# EAGLE design STM32BluePill (EAGLE 9.6.2)

## Sheet 1 of 5
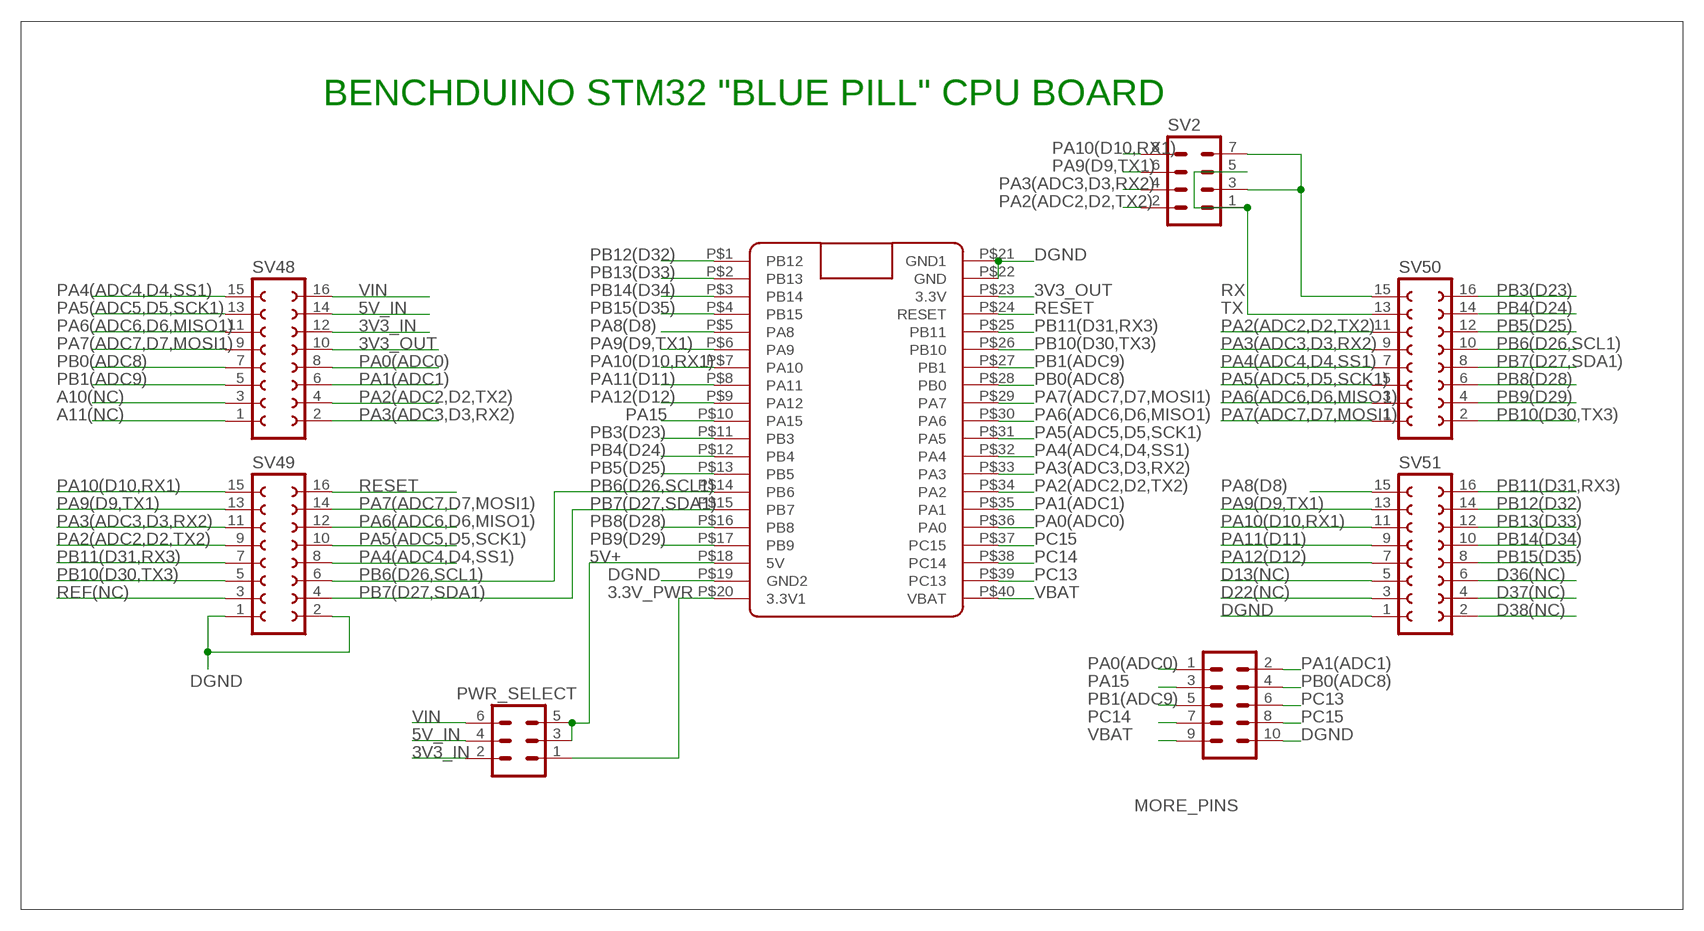
[diagram p0: schematic, sheet 1]

### Parts
MORE_PINS  MA05-2  [MA05-2]
PWR_SELECT  MA03-2  [MA03-2]
SV2  MA04-2  [MA04-2]
SV48  FE08-2  [FE08-2]
SV49  FE08-2  [FE08-2]
SV50  FE08-2  [FE08-2]
SV51  FE08-2  [FE08-2]
U$1  BLUE_PILLADVANCED  [BLUE_PILL_ADV]

### Nets
3.3V_PWR: PWR_SELECT.1 U$1.P$20(3.3V1)
3V3_IN: PWR_SELECT.2 SV48.12
3V3_OUT: SV48.10 U$1.P$23(3.3V)
5V+: PWR_SELECT.3 PWR_SELECT.5 U$1.P$18(5V)
5V_IN: PWR_SELECT.4 SV48.14
A10(NC): SV48.3
A11(NC): SV48.1
D13(NC): SV51.5
D22(NC): SV51.3
D36(NC): SV51.6
D37(NC): SV51.4
D38(NC): SV51.2
DGND: MORE_PINS.10 SV49.1 SV49.2 SV51.1 U$1.P$19(GND2) U$1.P$21(GND1) U$1.P$22(GND)
PA0(ADC0): MORE_PINS.1 SV48.8 U$1.P$36(PA0)
PA1(ADC1): MORE_PINS.2 SV48.6 U$1.P$35(PA1)
PA2(ADC2,D2,TX2): SV2.2 SV48.4 SV49.9 SV50.11 U$1.P$34(PA2)
PA3(ADC3,D3,RX2): SV2.4 SV48.2 SV49.11 SV50.9 U$1.P$33(PA3)
PA4(ADC4,D4,SS1): SV48.15 SV49.8 SV50.7 U$1.P$32(PA4)
PA5(ADC5,D5,SCK1): SV48.13 SV49.10 SV50.5 U$1.P$31(PA5)
PA6(ADC6,D6,MISO1): SV48.11 SV49.12 SV50.3 U$1.P$30(PA6)
PA7(ADC7,D7,MOSI1): SV48.9 SV49.14 SV50.1 U$1.P$29(PA7)
PA8(D8): SV51.15 U$1.P$5(PA8)
PA9(D9,TX1): SV2.6 SV49.13 SV51.13 U$1.P$6(PA9)
PA10(D10,RX1): SV2.8 SV49.15 SV51.11 U$1.P$7(PA10)
PA11(D11): SV51.9 U$1.P$8(PA11)
PA12(D12): SV51.7 U$1.P$9(PA12)
PA15: MORE_PINS.3 U$1.P$10(PA15)
PB0(ADC8): MORE_PINS.4 SV48.7 U$1.P$28(PB0)
PB1(ADC9): MORE_PINS.5 SV48.5 U$1.P$27(PB1)
PB3(D23): SV50.16 U$1.P$11(PB3)
PB4(D24): SV50.14 U$1.P$12(PB4)
PB5(D25): SV50.12 U$1.P$13(PB5)
PB6(D26,SCL1): SV49.6 SV50.10 U$1.P$14(PB6)
PB7(D27,SDA1): SV49.4 SV50.8 U$1.P$15(PB7)
PB8(D28): SV50.6 U$1.P$16(PB8)
PB9(D29): SV50.4 U$1.P$17(PB9)
PB10(D30,TX3): SV49.5 SV50.2 U$1.P$26(PB10)
PB11(D31,RX3): SV49.7 SV51.16 U$1.P$25(PB11)
PB12(D32): SV51.14 U$1.P$1(PB12)
PB13(D33): SV51.12 U$1.P$2(PB13)
PB14(D34): SV51.10 U$1.P$3(PB14)
PB15(D35): SV51.8 U$1.P$4(PB15)
PC13: MORE_PINS.6 U$1.P$39(PC13)
PC14: MORE_PINS.7 U$1.P$38(PC14)
PC15: MORE_PINS.8 U$1.P$37(PC15)
REF(NC): SV49.3
RESET: SV49.16 U$1.P$24(RESET)
RX: SV2.3 SV2.7 SV50.15
TX: SV2.1 SV2.5 SV50.13
VBAT: MORE_PINS.9 U$1.P$40(VBAT)
VIN: PWR_SELECT.6 SV48.16

### Notes on the sheet
- BENCHDUINO STM32 "BLUE PILL" CPU BOARD

## Sheet 2 of 5

## Sheet 3 of 5

## Sheet 4 of 5

## Sheet 5 of 5

## Library data of the parts
MORE_PINS = con-lstb:MA05-2: PIN HEADER; OC_FARNELL: unknown; OC_NEWARK: unknown
PWR_SELECT = con-lstb:MA03-2: PIN HEADER; OC_FARNELL: unknown; OC_NEWARK: unknown
SV2 = con-lstb:MA04-2: PIN HEADER; OC_FARNELL: unknown; OC_NEWARK: unknown
SV48-SV51 = con-lsta:FE08-2: FEMALE HEADER; OC_FARNELL: unknown; OC_NEWARK: unknown
U$1 = BluePill:BLUE_PILL

## Board
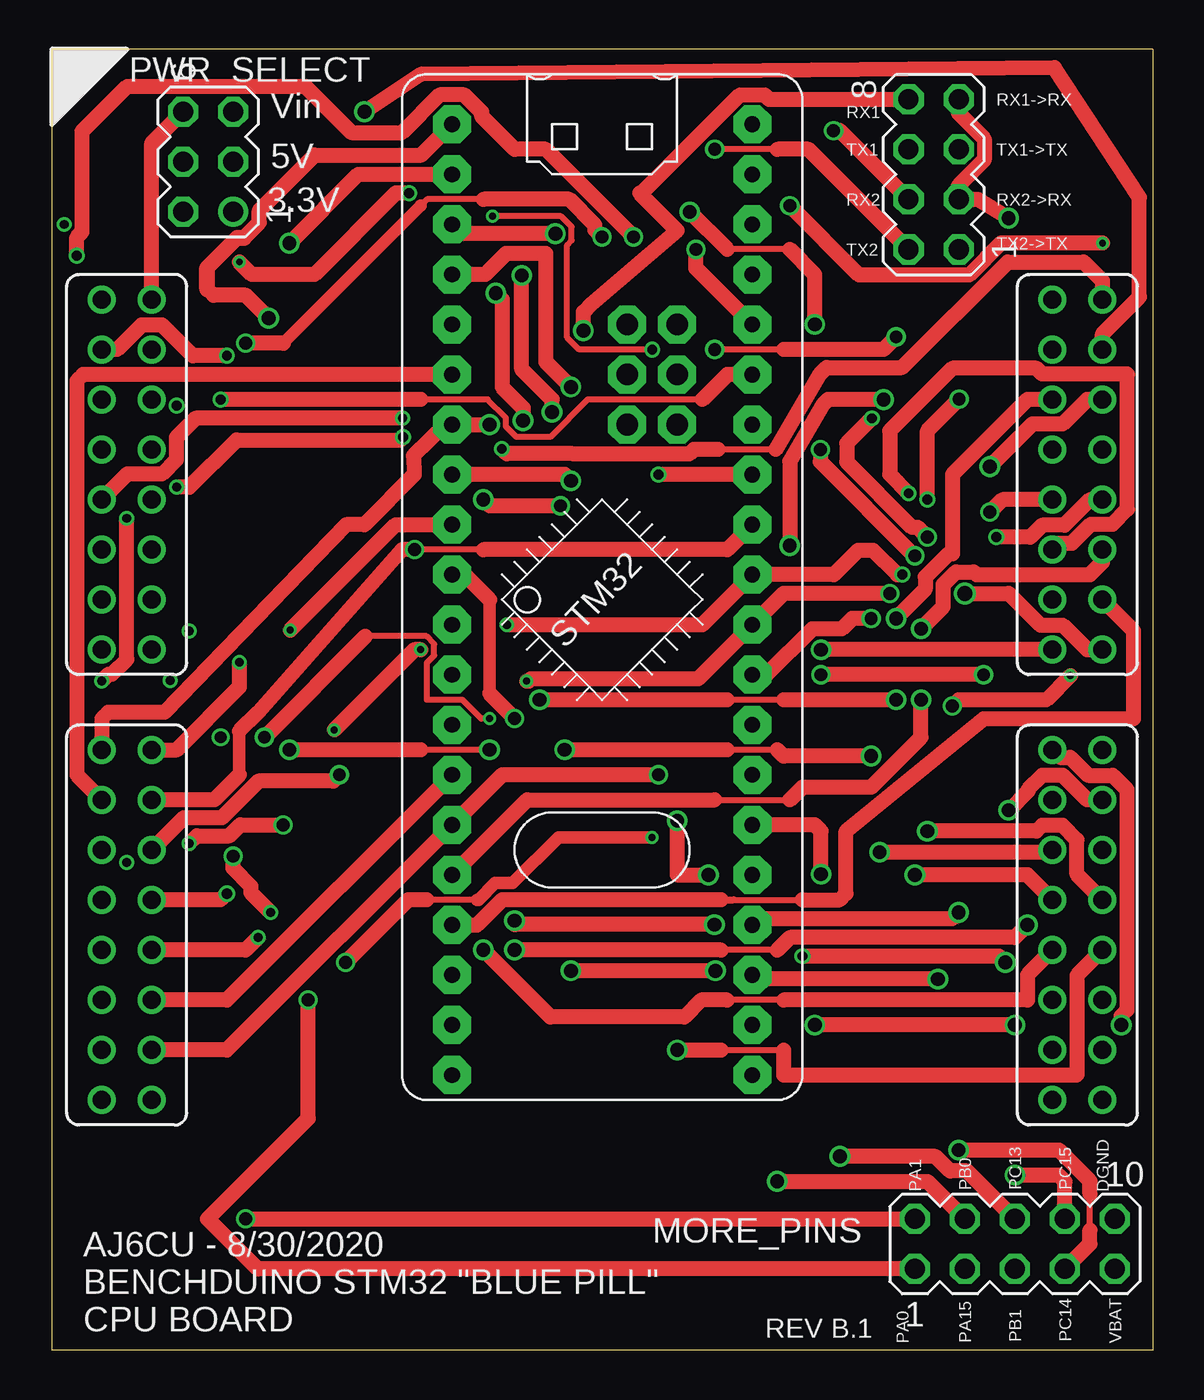
[diagram p1: board, top side]
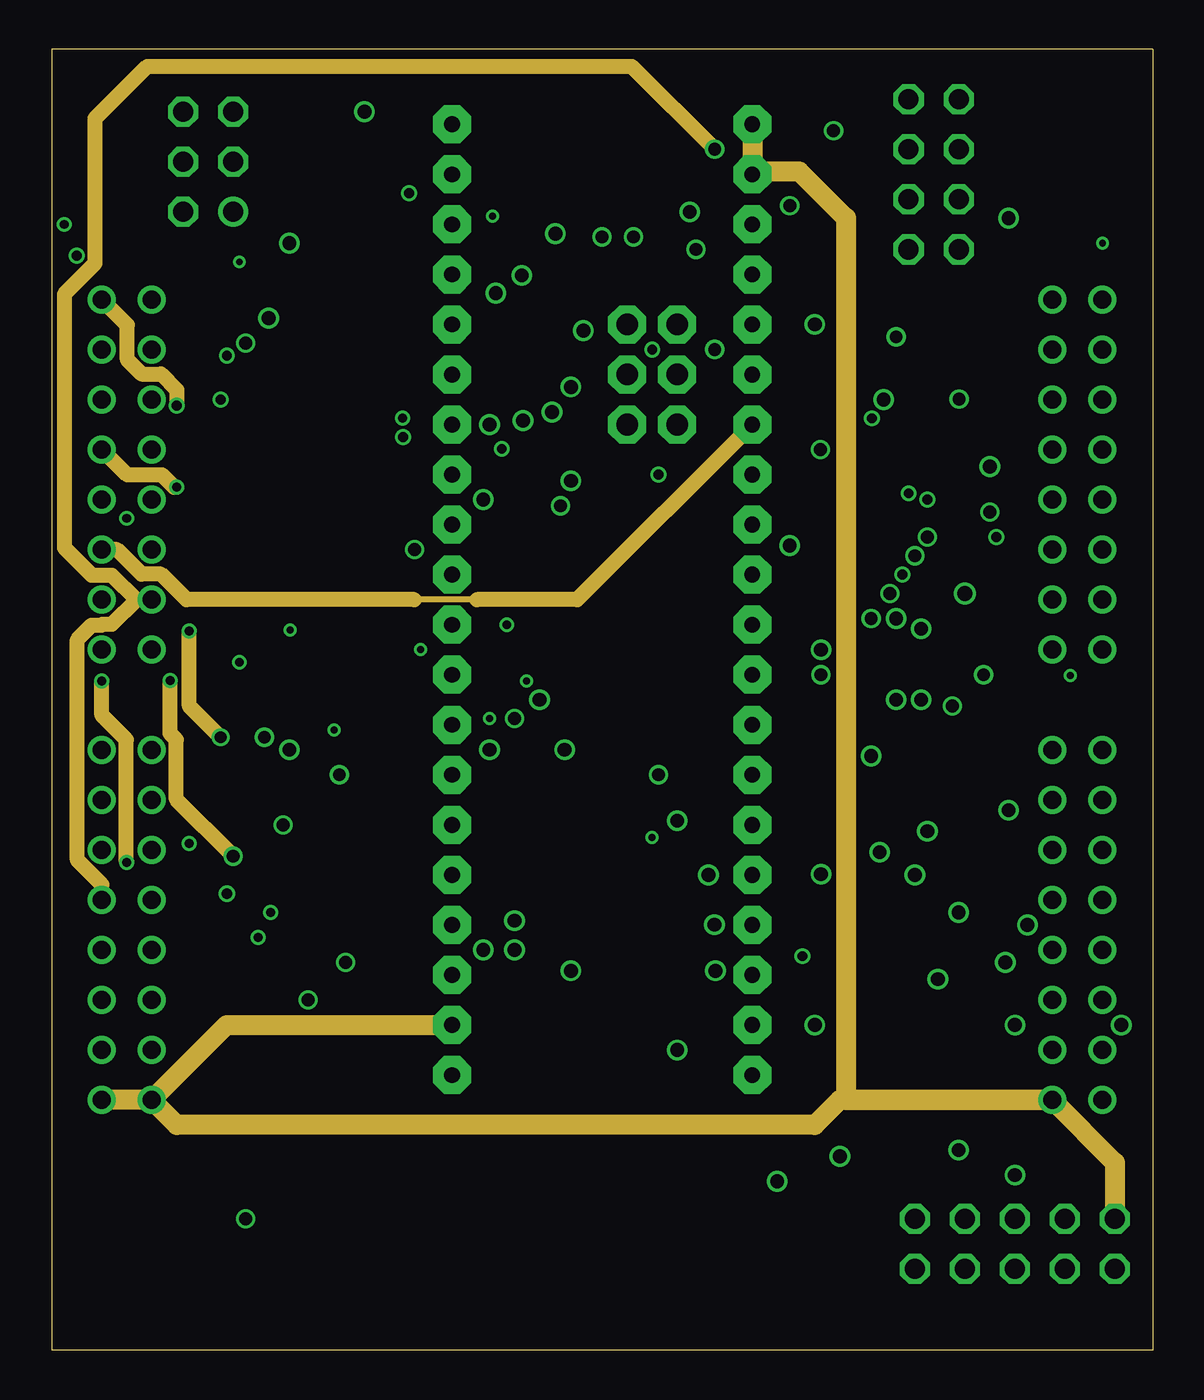
[diagram p2: board, inner layer Route2]
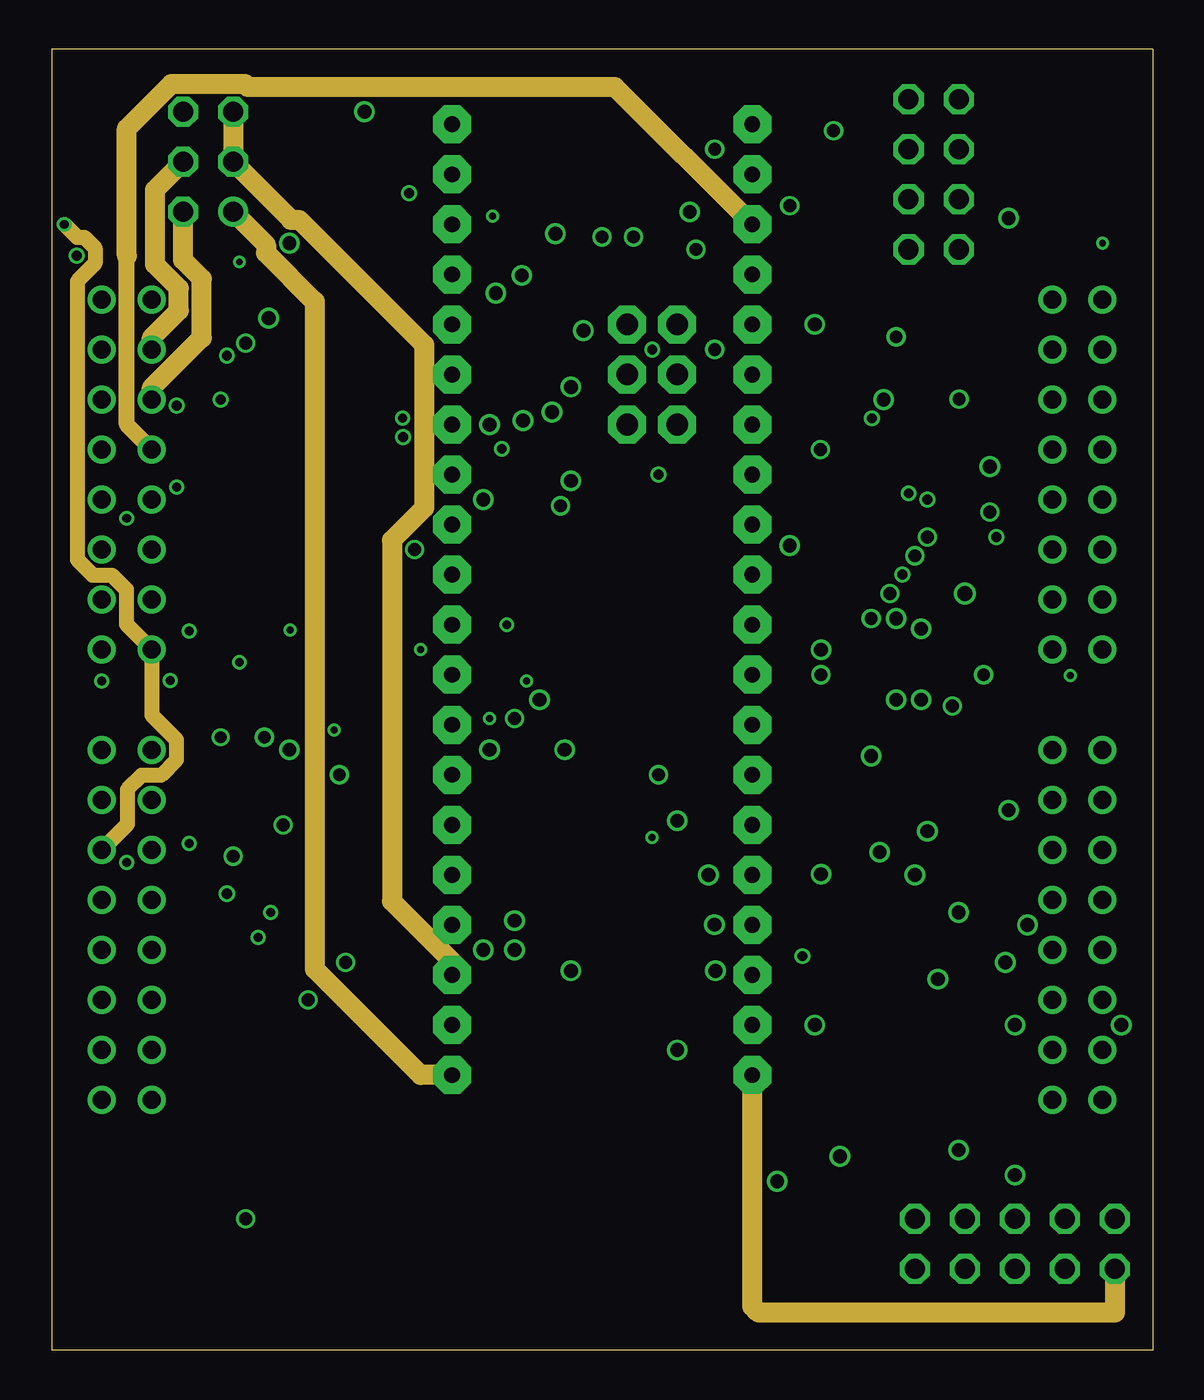
[diagram p3: board, inner layer Route15]
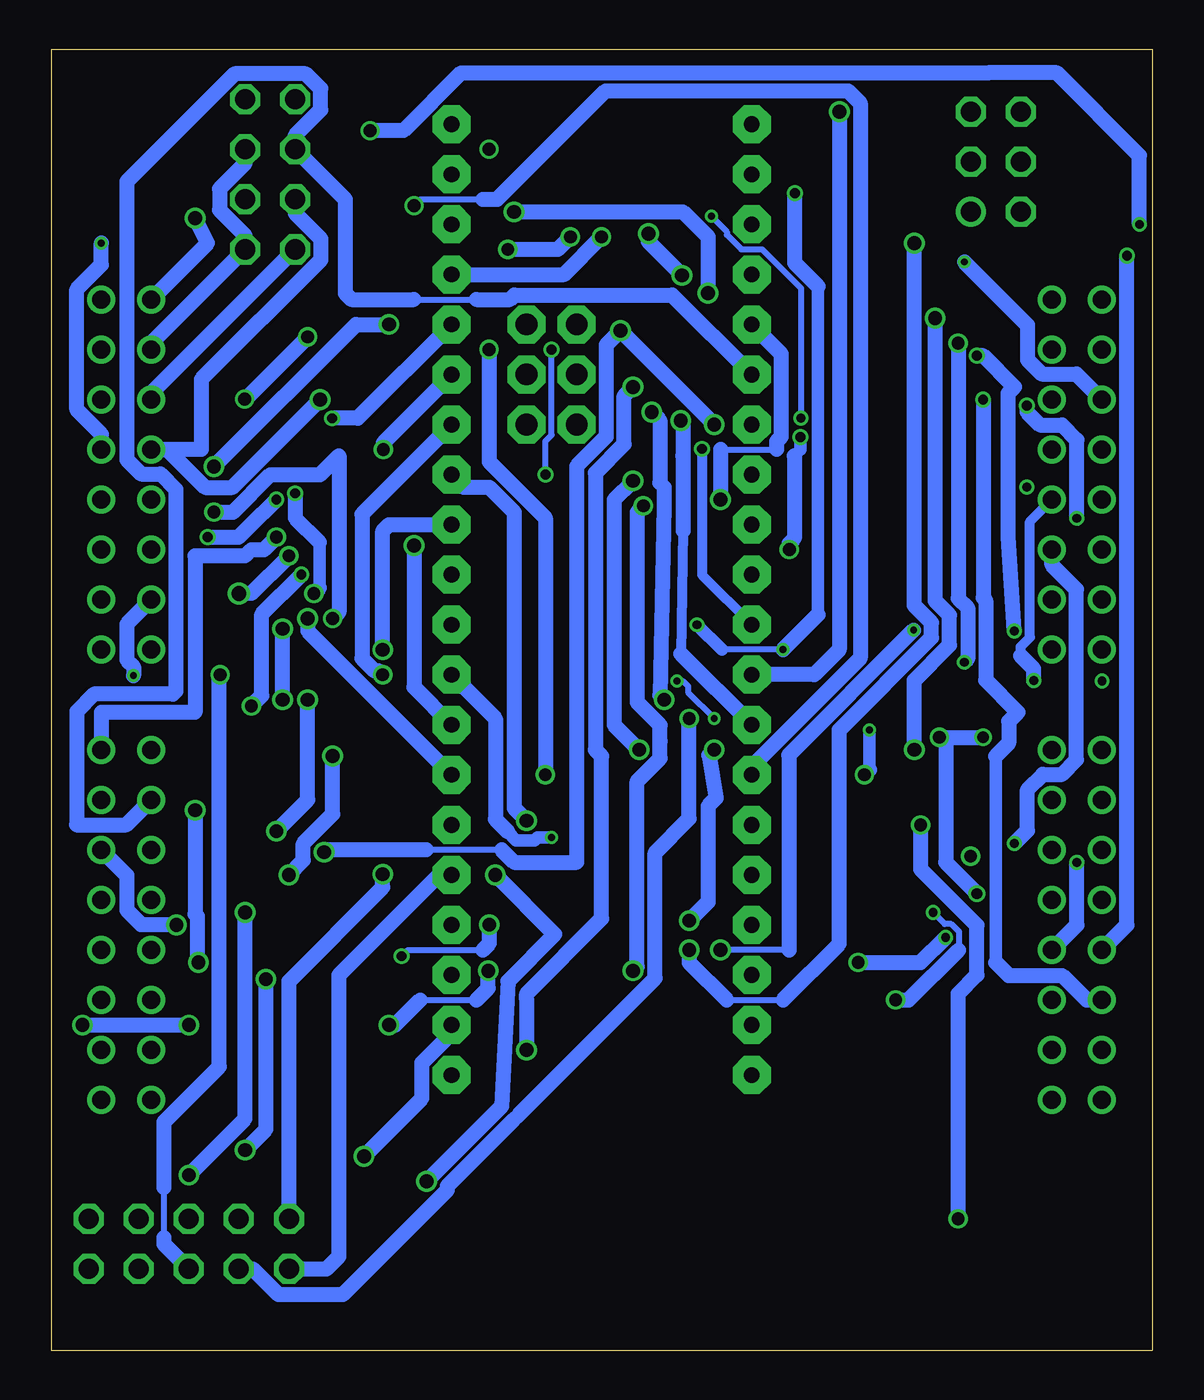
[diagram p4: board, bottom side, seen from below]

Size 55.88 x 66.04 mm. Coordinates in mm from the lower left corner, seen from the top.
Outline: 0,66.04 0,0 55.88,0 55.88,66.04 0,66.04
Copper layers (1*2*15*16): Top 0.035mm / dielectric 1.5mm / Route2 0.035mm / dielectric 0.15mm / Route15 0.035mm / dielectric 0.2mm / Bottom 0.035mm
Design rules "default *": minimum track width 6mil, minimum drill 12mil, track to track 6mil, track to pad 6mil, pad to pad 6mil, via to via 6mil, smd to smd 0mil, copper to edge 10mil, drill to drill 10mil, minimum pad ring 10mil, minimum via ring 6mil, stop-mask expansion 2mil, vias tented up to drill 100mil, thermal gap 10mil

### Footprints (pad centres in the part's own frame; a part is rotated, then mirrored left to right if it is on the bottom)
MA05-2 = drill 1.016 octagon: 1 -5.08,-1.27; 2 -5.08,1.27; 3 -2.54,-1.27; 4 -2.54,1.27; 5 0,-1.27; 6 0,1.27; 7 2.54,-1.27; 8 2.54,1.27; 9 5.08,-1.27; 10 5.08,1.27
MA03-2 = drill 1.016: 1 -2.54,-1.27 | drill 1.016 octagon: 2 -2.54,1.27; 3 0,-1.27; 4 0,1.27; 5 2.54,-1.27; 6 2.54,1.27
MA04-2 = drill 1.016 octagon: 1 -3.81,-1.27; 2 -3.81,1.27; 3 -1.27,-1.27; 4 -1.27,1.27; 5 1.27,-1.27; 6 1.27,1.27; 7 3.81,-1.27; 8 3.81,1.27
FE08-2 = drill 0.914: 1 -8.89,1.27; 2 -8.89,-1.27; 3 -6.35,1.27; 4 -6.35,-1.27; 5 -3.81,1.27; 6 -3.81,-1.27; 7 -1.27,1.27; 8 -1.27,-1.27; 9 1.27,1.27; 10 1.27,-1.27; 11 3.81,1.27; 12 3.81,-1.27; 13 6.35,1.27; 14 6.35,-1.27; 15 8.89,1.27; 16 8.89,-1.27
BLUE_PILL_ADV = drill 0.8 pad 1.93 octagon: P$1 10.16,-30.48; P$2 10.16,-27.94; P$3 10.16,-25.4; P$4 10.16,-22.86; P$5 10.16,-20.32; P$6 10.16,-17.78; P$7 10.16,-15.24; P$8 10.16,-12.7; P$9 10.16,-10.16; P$10 10.16,-7.62; P$11 10.16,-5.08; P$12 10.16,-2.54; P$13 10.16,0; P$14 10.16,2.54; P$15 10.16,5.08; P$16 10.16,7.62; P$17 10.16,10.16; P$18 10.16,12.7; P$19 10.16,15.24; P$20 10.16,17.78; P$21 -5.08,-30.48; P$22 -5.08,-27.94; P$23 -5.08,-25.4; P$24 -5.08,-22.86; P$25 -5.08,-20.32; P$26 -5.08,-17.78; P$27 -5.08,-15.24; P$28 -5.08,-12.7; P$29 -5.08,-10.16; P$30 -5.08,-7.62; P$31 -5.08,-5.08; P$32 -5.08,-2.54; P$33 -5.08,0; P$34 -5.08,2.54; P$35 -5.08,5.08; P$36 -5.08,7.62; P$37 -5.08,10.16; P$38 -5.08,12.7; P$39 -5.08,15.24; P$40 -5.08,17.78 | drill 1.1 pad 1.93 octagon: P$42 -1.27,-20.32; P$43 -1.27,-17.78; P$44 -1.27,-15.24; P$45 1.27,-15.24; P$46 1.27,-17.78; P$47 1.27,-20.32

### Placement (x,y rotation side)
MORE_PINS  48.9,5.4 0 top
PWR_SELECT  7.94,60.33 90 top
SV2  44.77,59.69 90 top
SV48  3.81,44.45 90 top
SV49  3.81,21.59 90 top
SV50  52.07,44.45 90 top
SV51  52.07,21.59 90 top
U$1  30.48,31.75 180 top

### Tracks (layer width: path | path; a pad name or v marks a point on that pad's centre or on a via)
3.3V_PWR
  Route15 1.016: U$1.P$20 18.73,13.97 13.35,19.36 13.35,53.24 10.88,55.71 10.88,56.11 PWR_SELECT.1
3V3_IN
  Route15 1.016: SV48.12 5.08,48.86 7.62,51.4 7.62,54.39 6.67,55.34 PWR_SELECT.2
3V3_OUT
  Route15 0.813: SV48.10 3.81,46.99 3.81,55.56
  Route15 1.016: U$1.P$23 28.57,64.14 11.75,64.14 11.06,64.14 9.95,64.14 9.8,64.29 6.08,64.29 3.81,62.02 3.81,55.56
5V+
  Route15 1.016: PWR_SELECT.5 PWR_SELECT.3 12.15,57.38 12.56,57.38 18.9,51.04 18.9,42.75 17.27,41.12 17.27,22.78 20.32,19.73 U$1.P$18
5V_IN
  Route15 1.016: SV48.14 5.08,51.4 6.45,52.77 6.45,53.91 5.25,55.12 5.25,58.9 PWR_SELECT.4
DGND
  Route2 1.016: SV49.2 SV49.1 | SV51.1 40.32,12.7 40.32,57.47 37.94,59.85 35.72,59.85 U$1.P$22 U$1.P$21 | SV51.1 53.98,9.53 MORE_PINS.10 | SV49.2 8.89,16.51 U$1.P$19 | SV51.1 40.01,12.7 38.73,11.43 6.35,11.43 SV49.2
PA0(ADC0)  (via drill 0.45, 0.65)
  Top 0.762: v13.02,17.78 13.02,11.77 7.91,6.67 10.45,4.13 MORE_PINS.1 | v11.11,22.23 10.12,23.22 10.12,23.56 9.21,24.47 v9.21,25.08
  Route2 0.762: v9.21,25.08 6.33,27.96 6.33,31 6.01,31.31 v6.01,34
  Bottom 0.305: v11.11,22.23 10.53,21.64 10.19,21.64 9.79,21.24 9.79,20.35 9.83,20.31
  Bottom 0.508: SV48.8 6.2,42.06 6.2,36.19 6.67,35.72 6.67,35.24
  Bottom 0.762: MORE_PINS.1 41.91,4.13 41.27,4.76 41.27,19.05 36.2,24.13 U$1.P$36 | v13.02,17.78 12.36,17.78 9.83,20.31 | v6.01,34 6.01,34.58 6.67,35.24
PA1(ADC1)  (via drill 0.45, 0.65, 0.7)
  Top 0.762: v39.05,24.17 39.05,26.35 38.73,26.67 U$1.P$35 | v6.99,25.72 7.38,26.11 9.01,26.11 9.57,26.67 v11.75,26.67 | v9.84,6.67 MORE_PINS.2
  Bottom 0.762: MORE_PINS.2 43.81,18.73 39.05,23.5 v39.05,24.17 | v9.84,6.67 9.84,18.1 8.89,19.05 8.89,21.57 11.75,24.42 v11.75,26.67 | v6.99,25.72 6.33,26.38 6.33,28.46 5.54,29.23 4.56,29.23 3.83,29.96 3.83,38.62 5.08,39.86 SV48.6
PA2(ADC2,D2,TX2)  (via drill 0.65, 0.7)
  Top 0.305: 36.83,60.96 v33.66,60.96
  Top 0.762: SV50.11 49.53,48.26 45.72,44.45 45.72,40.43 45.52,40.43 44.34,39.25 44.34,38.63 v42.86,37.15 | SV2.2 38.42,60.96 36.83,60.96
  Route2 0.762: v33.66,60.96 29.44,65.18 4.85,65.18 2.21,62.53 2.21,55.17 0.64,53.6 0.64,40.73 2.02,39.34 3.06,39.34 4.3,38.1 | SV49.9 2.54,23.64 1.29,24.88 1.29,36.08 2.02,36.8 2.52,36.8 2.56,36.85 3.06,36.85 4.3,38.1 | 4.3,38.1 SV48.4
  Bottom 0.762: SV2.2 50.8,48.58 SV50.11 | v42.86,37.15 42.86,36.51 U$1.P$34
PA3(ADC3,D3,RX2)  (via drill 0.45, 0.65, 0.7)
  Top 0.762: v42.23,48.26 39.41,48.26 39.16,48.01 37.47,45.12 v37.47,40.85 | SV2.4 40.01,61.91 v39.69,61.91
  Route15 0.762: v0.64,57.15 1.29,56.5 1.66,56.5 2.21,55.95 2.21,55.17 1.29,54.26 1.29,40.12 2.08,39.34 3.06,39.34 3.79,38.62 3.79,36.85 SV48.2 5.08,32.24 6.33,31 6.33,29.96 5.54,29.18 4.56,29.18 3.83,28.46 3.83,26.7 SV49.11
  Bottom 0.762: SV2.4 43.5,57.71 42.2,56.42 42.2,55.34 48.26,49.29 48.26,45.72 SV50.9 49.98,45.72 48.06,43.8 46.69,43.8 v42.23,48.26 | v37.47,40.85 37.47,33.66 U$1.P$33 | v39.69,61.91 38,61.91 35.07,64.84 8.89,64.84 8.32,64.84 4.83,64.84 0.64,60.64 v0.64,57.15
PA4(ADC4,D4,SS1)  (via drill 0.35, 0.45, 0.5, 0.65)
  Top 0.305: 21.59,22.86 19.05,22.86
  Top 0.635: v30.48,26.04 25.72,26.04 23.39,23.71 22.51,23.71 21.66,22.86 21.59,22.86
  Top 0.762: SV50.7 48.26,43.18 v47.62,42.55 | v41.59,37.15 40.64,37.15 40.11,36.62 38.61,36.62 36.29,34.29 U$1.P$32 | 19.05,22.86 18.1,22.86 v14.92,19.68 | v10.48,20.95 9.84,20.32 SV49.8 | v2.54,33.97 2.88,34.31 3.06,34.31 3.81,35.07 v3.81,42.23
  Route2 0.762: v3.81,24.77 3.79,24.79 3.79,31 2.54,32.24 v2.54,33.97 | SV48.15 3.83,52.05 3.83,50.28 4.56,49.55 5.54,49.55 6.35,48.75 v6.35,47.94
  Bottom 0.635: v30.48,26.04 31.19,26.04 31.34,25.89 32.27,25.89 32.7,26.31
  Bottom 0.762: v47.62,42.55 46.65,42.55 44.76,44.44 42.24,44.44 41.27,45.4 41.27,37.47 v41.59,37.15 | U$1.P$32 33.34,32.07 33.34,26.95 32.7,26.31 | v14.92,19.68 11.75,19.68 v10.48,20.95 | SV49.8 3.81,21.59 v3.81,24.77 | v3.81,42.23 3.81,46.21 4.56,46.97 5.69,46.97 6.35,47.62 v6.35,47.94
PA5(ADC5,D5,SCK1)  (via drill 0.35, 0.45, 0.5, 0.55, 0.6, 0.65)
  Top 0.305: v22.23,32.07 21.8,32.07 20.85,33.02 19.05,33.02 19.05,34.91 19.42,35.28 19.42,35.84 19.02,36.25 15.93,36.25
  Top 0.762: SV50.5 51.13,40.97 51.79,40.97 52.75,41.94 53.86,41.94 54.61,42.69 54.61,49.53 54.59,49.55 50.28,49.55 49.99,49.85 45.72,49.85 42.55,46.67 42.55,44.45 v43.5,43.5 | v42.55,38.42 37.15,38.42 U$1.P$31 32.81,34.08 24.33,34.08 24.21,33.97 v24.11,33.97 | 15.93,36.25 v10.79,31.11 | v8.89,23.18 8.57,22.86 SV49.10 | v8.89,50.48 7.16,50.48 5.6,52.05 4.56,52.05 3.32,50.8 SV48.13
  Route2 0.762: v8.57,31.11 6.99,32.7 v6.99,36.51
  Bottom 0.305: v24.11,33.97 23.8,33.97 23.55,33.71 23.55,33.39 v22.23,32.07
  Bottom 0.635: 42.27,41.02 42.27,38.7
  Bottom 0.762: v43.5,43.5 43.5,42.25 42.27,41.02 | 42.27,38.7 v42.55,38.42 | v8.89,23.18 10.48,24.77 10.48,30.8 v10.79,31.11 v8.57,31.11 | v6.99,36.51 7.3,41.27 7.3,48.58 6.99,48.9 8.57,50.48 v8.89,50.48
PA6(ADC6,D6,MISO1)  (via drill 0.35, 0.45, 0.5, 0.65)
  Top 0.762: v51.71,34.24 50.48,33.02 46.04,33.02 v45.72,32.7 | v43.18,39.37 42.92,39.37 41.69,40.6 40.93,40.6 39.7,39.37 U$1.P$30 33.01,36.82 v23.1,36.82 | v18.73,35.56 18.41,35.56 v14.34,31.49 | v14.34,31.49 | v14.61,29.21 14.29,28.89 10.5,28.89 8.63,27.03 6.71,27.03 SV49.12 | v18.13,58.74 17.46,58.74 13.34,54.61 10.16,54.61 v9.53,55.24
  Bottom 0.305: v18.73,35.56 21.84,35.56
  Bottom 0.635: v23.1,36.82 21.84,35.56 | v14.34,31.49 14.34,29.47 | 16.95,37.34 16.95,54.01
  Bottom 0.762: v51.71,34.24 51.71,34.71 52.05,35.04 52.05,36.85 SV50.3 | v45.72,32.7 45.19,33.23 45.19,37.36 v43.18,39.37 | v14.61,29.21 14.34,29.47 | v18.13,58.74 18.13,55.19 16.95,54.01 | v18.73,35.56 16.95,37.34 | v9.53,55.24 6.33,52.05 6.33,50.28 5.6,49.55 3.83,49.55 SV48.11
PA7(ADC7,D7,MOSI1)  (via drill 0.45, 0.5, 0.65, 0.7)
  Top 0.305: 21.91,40.64 v18.41,40.64
  Top 0.635: 9.53,31.43 9.53,29.21
  Top 0.762: SV50.1 v39.05,35.56 | U$1.P$29 34.29,40.64 21.91,40.64 | v18.41,40.64 17.78,40.64 10.48,32.38 9.53,31.43 | 9.53,29.21 8.26,27.94 SV49.14 | v6.35,43.81 6.99,43.81 9.38,46.21 17.69,46.21 v17.84,46.35
  Route2 0.762: v6.35,43.81 6.21,43.81 5.6,44.42 3.83,44.42 SV48.9
  Bottom 0.635: 18.16,45.4 17.84,45.72 v17.84,46.35
  Bottom 0.762: v39.05,35.56 39.05,41.59 38.73,41.91 U$1.P$29 | 18.16,45.4 18.16,41.22 18.41,40.96 v18.41,40.64
PA8(D8)  (via drill 0.65, 0.7)
  Top 0.762: SV51.15 51.18,30.1 51.69,30.1 52.61,29.18 53.86,29.18 54.59,28.46 54.59,17.26 54.29,16.97 v54.29,16.51 | v48.9,16.51 v38.73,16.51 | v33.7,19.26 v26.35,19.26 | v25.82,42.86 22.23,42.86 v21.91,43.18
  Bottom 0.305: 37.15,17.78 34.29,17.78 | 21.91,45.72 19.05,45.72
  Bottom 0.762: v54.29,16.51 v48.9,16.51 | v38.73,16.51 38.42,16.51 37.15,17.78 | 34.29,17.78 33.7,18.38 v33.7,19.26 | v26.35,19.26 26.14,19.47 26.14,28.88 24.98,30.04 24.98,30.92 24.98,31.73 26.14,32.9 26.14,42.55 v25.82,42.86 | 19.05,45.72 19.05,46.14 18.82,46.37 18.82,50.57 U$1.P$5 | 21.91,45.72 v21.91,43.18
PA9(D9,TX1)
  Top 0.762: U$1.P$6 1.59,49.53 1.27,49.21 1.27,29.21 SV49.13
  Bottom 0.305: 37.47,53.34 34.29,53.34
  Bottom 0.762: SV51.13 52.07,26.67 54.61,26.67 54.59,26.7 54.59,32.43 53.72,33.3 49.71,33.3 49.55,33.46 49.55,43.7 50.34,44.48 51.32,44.48 52.05,45.2 52.05,59.33 46.57,64.8 42.96,64.8 42.2,64.04 42.2,62.96 43.5,61.67 SV2.6 40.96,58.42 40.96,53.66 40.64,53.34 37.47,53.34 | 34.29,53.34 32.6,53.34 32.37,53.57 24.36,53.57 U$1.P$6
PA10(D10,RX1)  (via drill 0.7)
  Top 0.762: SV49.15 2.54,32.07 2.86,32.38 5.71,32.38 14.94,41.91 15.88,41.91 18.4,44.44 18.36,45.4 20,46.99 U$1.P$7 v22.23,46.99 | v26.99,51.75 26.99,52.7 27.38,53.1 31.75,56.83 29.84,58.74 29.95,58.74 34.94,63.73 36.18,63.73 36.41,63.5 SV2.8 | v42.02,25.29 50.69,25.29 SV51.11
  Bottom 0.305: 33.02,25.4 36.83,25.4
  Bottom 0.762: v22.23,46.99 v26.99,51.75 27.71,51.03 27.71,46.37 29.21,44.87 29.21,24.77 32.38,24.77 33.02,25.4 | 36.83,25.4 41.91,25.4 v42.02,25.29
PA11(D11)  (via drill 0.7)
  Top 0.305: 36.83,30.48 34.29,30.48
  Top 0.762: SV51.9 49.53,24.13 v43.81,24.13 | v41.59,30.16 37.15,30.16 36.83,30.48 | 34.29,30.48 v26.04,30.48 | v26.35,44.13 26.04,44.45 U$1.P$8
  Bottom 0.762: v43.81,24.13 43.08,24.86 43.08,25.73 41.59,27.21 v41.59,30.16 | v26.04,30.48 27.3,31.75 27.3,43.18 v26.35,44.13
PA12(D12)  (via drill 0.35, 0.7)
  Top 0.305: 37.15,17.78 34.29,17.78
  Top 0.762: v12.11,36.55 17.46,41.91 U$1.P$9 | SV51.7 49.53,19.05 49.53,17.78 37.15,17.78 | 34.29,17.78 32.97,17.78 32.11,16.92 25.31,16.92 v21.91,20.32
  Bottom 0.305: 18.41,20.32 v21.91,20.32
  Bottom 0.762: 18.41,20.32 18.41,30.16 18.45,30.2 v12.11,36.55
PA15  (via drill 0.65)
  Top 0.635: 22.23,38.1 22.23,33.34
  Top 0.762: v23.5,32.07 22.23,33.34 | 22.23,38.1 20.95,39.37 U$1.P$10
  Bottom 0.762: MORE_PINS.3 45.65,4.13 44.35,2.83 41.07,2.83 35.77,8.13 35.77,8.34 32.39,11.72 32.13,11.96 32.12,11.98 25.23,18.88 25.23,25.26 23.5,26.99 v23.5,32.07
PB0(ADC8)  (via drill 0.35, 0.45, 0.5, 0.7)
  Top 0.305: v22.37,57.56 25.86,57.56 26.4,57.02 26.4,56.34 26.16,56.1 26.16,51.41 26.77,50.8 v30.48,50.8
  Top 0.762: v31.75,26.88 31.75,24.13 v33.34,24.13 | v36.83,8.57 44.45,8.57 MORE_PINS.4 | v17.82,47.31 7.3,47.31 6.33,46.33 6.33,45.2 5.6,44.48 3.83,44.48 SV48.7 | U$1.P$28 v30.8,44.45
  Bottom 0.305: v30.8,44.45 30.8,46.15 30.48,46.46 v30.48,50.8 | v22.37,57.56 21.59,56.78 21.59,56.62 20.85,55.88 19.79,55.88 17.82,53.9 v17.82,47.31
  Bottom 0.762: U$1.P$28 34.92,43.81 33.66,43.81 32.38,42.55 32.38,27.52 v31.75,26.88 | v33.34,24.13 30.32,21.11 32.7,18.73 33.02,12.38 v36.83,8.57
PB1(ADC9)  (via drill 0.65)
  Top 0.762: v47.31,34.29 v39.05,34.29
  Route2 0.305: 21.59,38.1 18.41,38.1
  Route2 0.762: U$1.P$27 26.67,38.1 21.59,38.1 | 18.41,38.1 6.84,38.1 5.54,39.4 4.56,39.4 3.32,40.64 SV48.5
  Bottom 0.305: 50.16,8.26 50.16,5.71
  Bottom 0.762: 50.16,8.26 50.16,11.57 47.35,14.39 47.35,34.25 v47.31,34.29 | 50.16,5.71 50.16,5.4 MORE_PINS.5 | v39.05,34.29 39.26,34.5 39.49,34.5 40.11,35.12 40.11,42.44 U$1.P$27
PB3(D23)  (via drill 0.5)
  Top 0.305: 36.75,45.72 33.83,45.72
  Top 0.762: 36.75,45.72 39,49.55 39.33,49.89 43.17,49.89 48.53,55.24 52.39,55.24 53.34,54.29 SV50.16 | 33.83,45.72 32.6,45.72 32.37,45.49 26.49,45.49 26.47,45.51 23.09,45.51 v22.84,45.76
  Bottom 0.508: v22.84,45.76 22.84,39.35 U$1.P$11
PB4(D24)  (via drill 0.7)
  Top 0.762: SV50.14 53.34,51.58 55.22,53.46 55.22,58.52 50.9,65.11 18.73,64.77 v15.88,62.87
  Bottom 0.762: v15.88,62.87 15.88,35.56 17.14,34.29 U$1.P$12
PB5(D25)  (via drill 0.7)
  Top 0.305: 37.47,55.88 34.29,55.88
  Top 0.762: SV50.12 52.56,48.26 51.32,47.02 49.78,47.02 v47.62,44.86 | v38.73,52.07 38.73,54.61 37.47,55.88 | 34.29,55.88 v32.38,57.78 | v22.54,53.66 22.86,53.34 22.86,48.9 23.93,47.83 v23.93,47.19
  Bottom 0.508: 23.81,41.6 23.92,35.35
  Bottom 0.762: v47.62,44.86 40.41,52.07 v38.73,52.07 | v32.38,57.78 23.81,57.78 22.54,56.52 v22.54,53.66 | v23.93,47.19 23.81,47.08 23.81,45.4 23.81,41.6 | 23.92,35.35 U$1.P$13
PB6(D26,SCL1)  (via drill 0.35, 0.65)
  Top 0.762: U$1.P$14 8.89,17.78 SV49.6 | v53.34,56.2 48.19,56.2 46.57,54.59 40.98,54.59 v37.47,58.1
  Bottom 0.305: v37.47,58.1 37.15,58.42 33.97,58.42
  Bottom 0.762: SV50.10 53.34,46.5 54.59,47.74 54.59,53.86 53.34,55.1 v53.34,56.2 | 33.97,58.42 33.25,58.42 27.74,63.92 15.44,63.92 14.82,63.3 14.82,35.13 20.32,29.63 U$1.P$14
PB7(D27,SDA1)  (via drill 0.5, 0.65)
  Top 0.305: 37.15,50.8 v33.66,50.8
  Top 0.762: SV49.4 8.89,15.24 U$1.P$15 22.86,29.21 v30.8,29.21 | v47.94,41.27 49.67,41.27 50.28,41.88 51.41,41.88 52.7,43.18 SV50.8 | v44.45,43.18 44.45,46.67 v46.06,48.28 | v42.86,51.44 42.23,50.8 37.15,50.8
  Bottom 0.762: v47.94,41.27 46.38,41.27 45.15,42.51 45.12,42.51 v44.45,43.18 | v46.06,48.28 46.02,48.28 v42.86,51.44 | v30.8,29.21 30.8,42.25 33.66,45.11 v33.66,50.8
PB8(D28)  (via drill 0.7)
  Top 0.305: 33.66,27.94 37.47,27.94
  Top 0.762: U$1.P$16 24.13,27.94 33.66,27.94 | 37.47,27.94 38.1,28.57 41.59,28.57 44.13,31.11 v44.13,33.02 | v44.13,36.62 45.26,37.74 45.26,38.87 45.9,39.51 46.81,39.51 46.95,39.37 52.7,39.37 53.34,40.01 SV50.6
  Bottom 0.762: v44.13,33.02 v44.13,36.62
PB9(D29)
  Top 0.305: 34.61,22.86 38.1,22.86
  Top 0.356: 33.97,22.86 34.61,22.86
  Top 0.762: U$1.P$17 21.59,21.59 22.86,22.86 33.97,22.86 | SV50.4 54.93,36.51 54.93,32.07 47.31,32.07 40.32,26.35 40.32,23.18 40.01,22.86 38.1,22.86
PB10(D30,TX3)  (via drill 0.5, 0.65, 0.75)
  Top 0.305: 33.02,48.26 27.21,48.26 25.31,46.36 23.58,46.36 23.05,46.89 23.05,47.33 22.13,48.26 18.73,48.26
  Top 0.762: SV50.2 52.56,35.56 51.32,36.8 50.19,36.8 48.58,38.42 v46.35,38.42 | v39.02,45.72 39.02,45.1 43.79,40.32 v43.81,40.32 | U$1.P$26 34.29,49.53 33.02,48.26 | 18.73,48.26 v8.57,48.26
  Bottom 0.635: 7.94,30.16 7.94,19.68
  Bottom 0.762: U$1.P$26 39.02,46.07 v39.02,45.72 | v43.81,40.32 45.72,38.42 v46.35,38.42 | v8.57,48.26 8.57,38.19 8.45,38.07 8.45,34.02 6.81,32.38 7.28,31.92 7.28,30.82 7.94,30.16 | 7.94,19.68 7.28,19.02 4.56,19.02 3.32,17.78 SV49.5
PB11(D31,RX3)  (via drill 0.5, 0.65)
  Top 0.762: v44.45,41.27 43.96,41.77 43.67,41.77 40.36,45.09 40.36,46.04 v41.63,47.31 | U$1.P$25 32.7,54.93 v32.7,55.88 | v29.53,56.52 25.08,60.96 23.5,60.96 21.82,62.64 21.82,62.85 20.94,63.73 19.7,63.73 17.78,61.81 15.22,61.81 12.87,64.16 6.99,64.16 6.13,64.16 3.83,64.16 1.55,61.87 1.55,56.77 1.27,56.5 v1.27,55.56
  Bottom 0.762: SV51.16 53.34,32.38 48.58,32.38 48.58,40.32 46.04,40.32 45.72,40.64 45.09,40.64 v44.45,41.27 | U$1.P$25 40.32,47.31 v41.63,47.31 | v32.7,55.88 30.16,55.88 v29.53,56.52 | SV49.7 1.27,21.59 v1.27,55.56
PB12(D32)  (via drill 0.5, 0.7)
  Top 0.305: v22.23,30.48 18.73,30.48
  Top 0.762: SV51.14 52.56,27.94 51.32,29.18 50.28,29.18 49.55,28.46 49.55,28.39 v48.58,27.41 | v48.4,19.68 48.09,20 v38.1,20 | v33.64,21.6 23.5,21.6 v23.5,21.8 | 18.73,30.48 v12.06,30.48 | 7.9,53.86 8.21,53.55 9.85,53.55 v11.01,52.39 | U$1.P$1 18.75,60.66 13.34,60.66 10.53,57.86 10.53,57.24 9.76,56.46 | 7.9,54.95 9.41,56.46
  Top 0.813: 7.9,53.86 7.9,54.95 | 9.41,56.46 9.76,56.46
  Bottom 0.305: v38.1,20 37.78,20.32 33.97,20.32
  Bottom 0.762: v48.58,27.41 48.58,22.13 48.47,22.03 48.47,19.75 v48.4,19.68 | 33.97,20.32 33.64,20.65 v33.64,21.6 | v23.5,21.8 22.54,22.75 22.54,27.62 22.13,28.03 22.5,30.21 v22.23,30.48 | v12.06,30.48 12.06,34.01 10.28,35.8 10.28,37.31 11.01,38.04 v11.01,52.39
PB13(D33)  (via drill 0.7)
  Top 0.305: 36.83,20.32 33.97,20.32
  Top 0.762: v49.53,21.59 48.9,20.95 37.47,20.95 36.83,20.32 | 33.97,20.32 v23.5,20.32 | v12.06,56.2 15.56,59.69 U$1.P$2
  Bottom 0.305: 21.59,17.78 18.73,17.78
  Bottom 0.762: SV51.12 52.05,24.11 52.05,22.34 51.32,21.61 49.55,21.61 v49.53,21.59 | v23.5,20.32 23.5,19.68 21.59,17.78 | 18.73,17.78 15.88,20.64 15.88,31.49 11.19,36.17 11.19,36.93 12.06,37.81 v12.06,56.2
PB14(D34)  (via drill 0.7)
  Top 0.305: 37.15,33.02 34.29,33.02
  Top 0.762: SV51.10 52.05,24.16 52.05,25.92 51.32,26.64 50.28,26.64 49.99,26.35 v44.45,26.35 | v42.86,33.02 37.15,33.02 | 34.29,33.02 v24.77,33.02 | v25.4,47.62 25.4,48.26 23.86,49.8 v23.86,54.56 | v25.57,56.68 20.79,56.68 U$1.P$3
  Bottom 0.762: v44.45,26.35 42.86,27.94 v42.86,33.02 | v24.77,33.02 24.98,33.24 24.77,42.86 24.77,43.81 24.98,44.03 24.98,47.21 v25.4,47.62 | v23.86,54.56 25.57,56.27 v25.57,56.68
PB15(D35)  (via drill 0.7)
  Top 0.305: 33.97,15.24 37.15,15.24
  Top 0.762: SV51.8 52.05,19.02 52.05,13.99 52.02,13.97 37.15,13.97 37.15,15.24 | v26.35,48.9 25.08,50.16 25.08,55.67 23.06,55.67 22,54.61 U$1.P$4 | v31.75,15.24 33.97,15.24
  Bottom 0.762: v26.35,48.9 26.8,48.45 26.8,45.99 28.26,44.53 28.26,30.48 27.94,30.16 27.94,21.91 31.75,18.1 31.75,17.78 v31.75,15.24
PC13  (via drill 0.7)
  Top 0.762: MORE_PINS.6 46.46,9.1 45.6,9.1 44.86,9.84 v40.01,9.84
  Bottom 0.762: v40.01,9.84 37.06,12.79 37.06,14.59 35.56,16.09 U$1.P$39
PC14  (via drill 0.7)
  Top 0.305: 52.7,6.11 52.7,7.94
  Top 0.762: MORE_PINS.7 52.7,5.4 52.7,6.11 | 52.7,7.94 52.7,8.6 51.14,10.16 v46.04,10.16 | v44.98,18.84 35.77,18.84 U$1.P$38
  Bottom 0.762: v46.04,10.16 44.98,11.22 v44.98,18.84
PC15  (via drill 0.7)
  Top 0.762: MORE_PINS.8 51.44,8.57 51.12,8.89 v48.9,8.89 | v46.04,22.23 45.71,21.9 35.87,21.9 U$1.P$37
  Bottom 0.762: v48.9,8.89 46.04,11.75 v46.04,22.23
RESET  (via drill 0.45, 0.65)
  Top 0.305: 21.91,58.42 19.05,58.42 18.73,58.1
  Top 0.635: 18.73,58.1 11.75,51.12
  Top 0.762: v27.94,56.52 27.58,56.88 27.58,57.12 26.28,58.42 21.91,58.42 | 11.75,51.12 v9.84,51.12 | v9.53,34.92 9.53,33.66 6.35,30.48 SV49.16
  Bottom 0.762: U$1.P$24 29.84,54.61 v27.94,56.52 | v9.84,51.12 9.84,38.17 9.36,37.69 9.36,35.09 v9.53,34.92
RX  (via drill 0.7)
  Top 0.762: SV2.7 46.04,62.79 47.33,61.5 47.33,60.42 46.04,59.13 SV2.3 46.99,58.42 v48.58,57.47
  Bottom 0.762: v48.58,57.47 47.94,56.2 SV50.15
TX
  Bottom 0.762: SV2.5 46.04,60.25 47.33,58.96 47.33,57.88 46.04,56.59 SV2.1 50.8,51.12 SV50.13
VBAT
  Route15 1.016: MORE_PINS.9 53.98,1.91 35.88,1.91 35.56,2.22 U$1.P$40
VIN
  Top 0.762: SV48.16 5.08,61.28 PWR_SELECT.6

### Text on the board
tNames: Vin | RX1 | RX1->RX | TX1 | TX1->TX | 5V | 3.3V | RX2 | RX2->RX | TX2 | TX2->TX | DGND | PA1 | PB0 | PC13 | PC15 | PA15 | PC14 | VBAT | PA0 | PB1 | AJ6CU - 8/30/2020 / BENCHDUINO STM32 "BLUE PILL" / CPU BOARD | REV B.1